# EAGLE design DCDC-BASE-X2 (EAGLE 9.6.2)
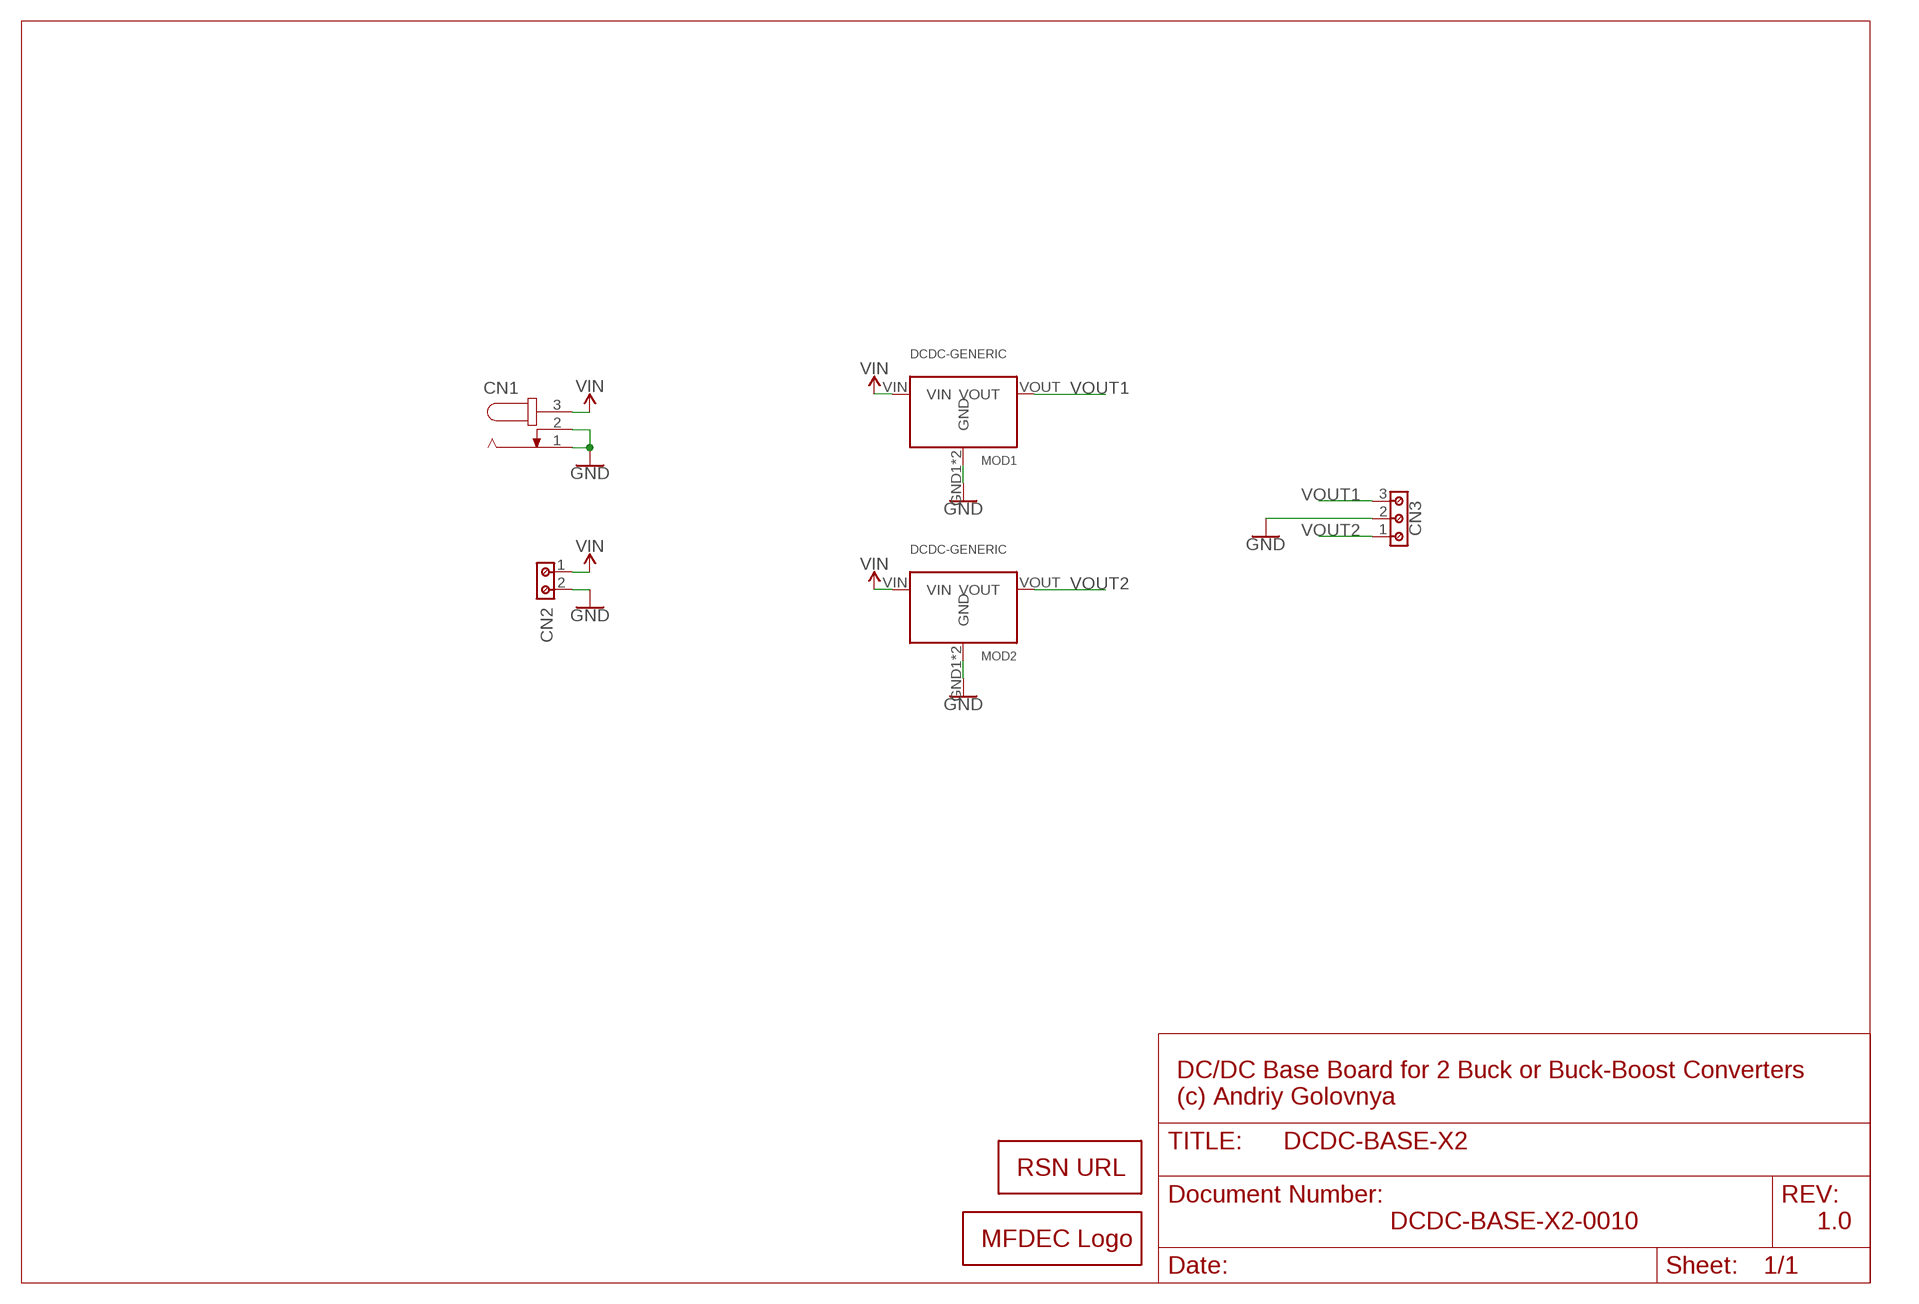
[diagram p0: schematic, sheet 1]

## Parts
CN1  JACK-PLUG1  [SPC4078]
CN2  691213510002  [691213510002]
CN3  691213510003  [691213510003]
LOGO1  RSNURL_QR_8MM  [RSNURL_QR_8MM]
LOGO2  MFDECLOGO_L_10MM  [MFDEC_L_10MM]
MOD1  DCDC-GENERIC  [DCDC-BOARD]
MOD2  DCDC-GENERIC  [DCDC-BOARD]

## Nets
GND: CN1.1 CN1.2 CN2.2 CN3.2 MOD1.GND1(GND) MOD1.GND2(GND) MOD2.GND1(GND) MOD2.GND2(GND)
VIN: CN1.3 CN2.1 MOD1.VIN MOD2.VIN
VOUT1: CN3.3 MOD1.VOUT
VOUT2: CN3.1 MOD2.VOUT

## Notes on the sheet
- DC/DC Base Board for 2 Buck or Buck-Boost Converters
  (c) Andriy Golovnya
- DCDC-BASE-X2-0010 | 1.0

## Library data of the parts
CN1 = con-jack:JACK-PLUG: DC POWER JACK Power Jack, DC, Right Angle, Through Hole, Rated 5A at 16VDC, PC Terminals Distributor: Farnell (www.Farnell.de) Drawing: 84N1161.pdf / 84N1162.pdf Manufacturer: SPC Technology (www.spctechnology.com) Type: SPC4077 / SPC 4078; OC_FARNELL: unknown; OC_NEWARK: unknown
CN2 = Wurth_Connectors_WR-TBL Rising Cage Clamp:691213510002: WR-TBL Serie 2135 - 5.08 mm Horizontal Entry Modular w. Rising Cage Clamp KIND PROPERTIES Pitch 5.08 mm MATERIAL PROPERTIES Insulator Material PA66 Insulator Flammability Rating UL94 V-0 Contact Material Copper Alloy Contact Plating Tin over Nickel Contact Type Stamped Terminal Screw Material Steel Terminal Screw Plating Zinc Wire Guard Material Copper Alloy GENERAL INFORMATION Operating Temperature -30 up to +120 °C Compliance ROHS & Reach ELECTRICAL PROPERTIES IR UL 14 A IR VDE 14 A Working Voltage [UL] 300 V (AC) Working Voltage [VDE] 250 V (AC) Withstanding Voltage [UL] 1600 V (AC) Withstanding Voltage [VDE] 2000 V (AC) Contact Resistance 20 mΩ MECHANICAL PROPERTIES Wire Strip Length 6 Screw M3 CERTIFICATION UL Approval E150931 VDE Approval 40021366 PACKAGING PROPERTIES Packaging Box <https://www.we-online.com/catalog/media/o32805v209%20Family_WR-TBL2_Series2135.jpg> Details see: https://www.we-online.com/catalog/en/TBL_5_08_2135_HORIZONTAL_ENTRY_MODULAR_69121351000x/ Updated by Ella Wu 2019-11-26 2019(C) Wurth Elektronik; IR-UL: 14A; IR-VDE: 14A; PART-NUMBER: 691213510002; PINS: 2; PITCH: 5.08mm; TYPE: Horizontal; WIRE: 14 to 30 (AWG) 2.08 to 0.0509 (mm²); WORKING-VOLTAGE-UL: 300V (AC); WORKING-VOLTAGE-VDE: 250V (AC)
CN3 = Wurth_Connectors_WR-TBL Rising Cage Clamp:691213510003: WR-TBL Serie 2135 - 5.08 mm Horizontal Entry Modular w. Rising Cage Clamp KIND PROPERTIES Pitch 5.08 mm MATERIAL PROPERTIES Insulator Material PA66 Insulator Flammability Rating UL94 V-0 Contact Material Copper Alloy Contact Plating Tin over Nickel Contact Type Stamped Terminal Screw Material Steel Terminal Screw Plating Zinc Wire Guard Material Copper Alloy GENERAL INFORMATION Operating Temperature -30 up to +120 °C Compliance ROHS & Reach ELECTRICAL PROPERTIES IR UL 14 A IR VDE 14 A Working Voltage [UL] 300 V (AC) Working Voltage [VDE] 250 V (AC) Withstanding Voltage [UL] 1600 V (AC) Withstanding Voltage [VDE] 2000 V (AC) Contact Resistance 20 mΩ MECHANICAL PROPERTIES Wire Strip Length 6 Screw M3 CERTIFICATION UL Approval E150931 VDE Approval 40021366 PACKAGING PROPERTIES Packaging Box <https://www.we-online.com/catalog/media/o32805v209%20Family_WR-TBL2_Series2135.jpg> Details see: https://www.we-online.com/catalog/en/TBL_5_08_2135_HORIZONTAL_ENTRY_MODULAR_69121351000x/ Updated by Ella Wu 2019-11-26 2019(C) Wurth Elektronik; IR-UL: 14A; IR-VDE: 14A; PART-NUMBER: 691213510003; PINS: 3; PITCH: 5.08mm; TYPE: Horizontal; WIRE: 14 to 30 (AWG) 2.08 to 0.0509 (mm²); WORKING-VOLTAGE-UL: 300V (AC); WORKING-VOLTAGE-VDE: 250V (AC)
LOGO1 = _my_logos:RSNURL: RedScorp.Net URL
LOGO2 = _my_logos:MFDECLOGO: Midnight Fog - Digital Eye Candy LOGO
MOD1 MOD2 = DCDC:DCDC-GENERIC

## Net classes
0 default: width 0.254 mm

## Board
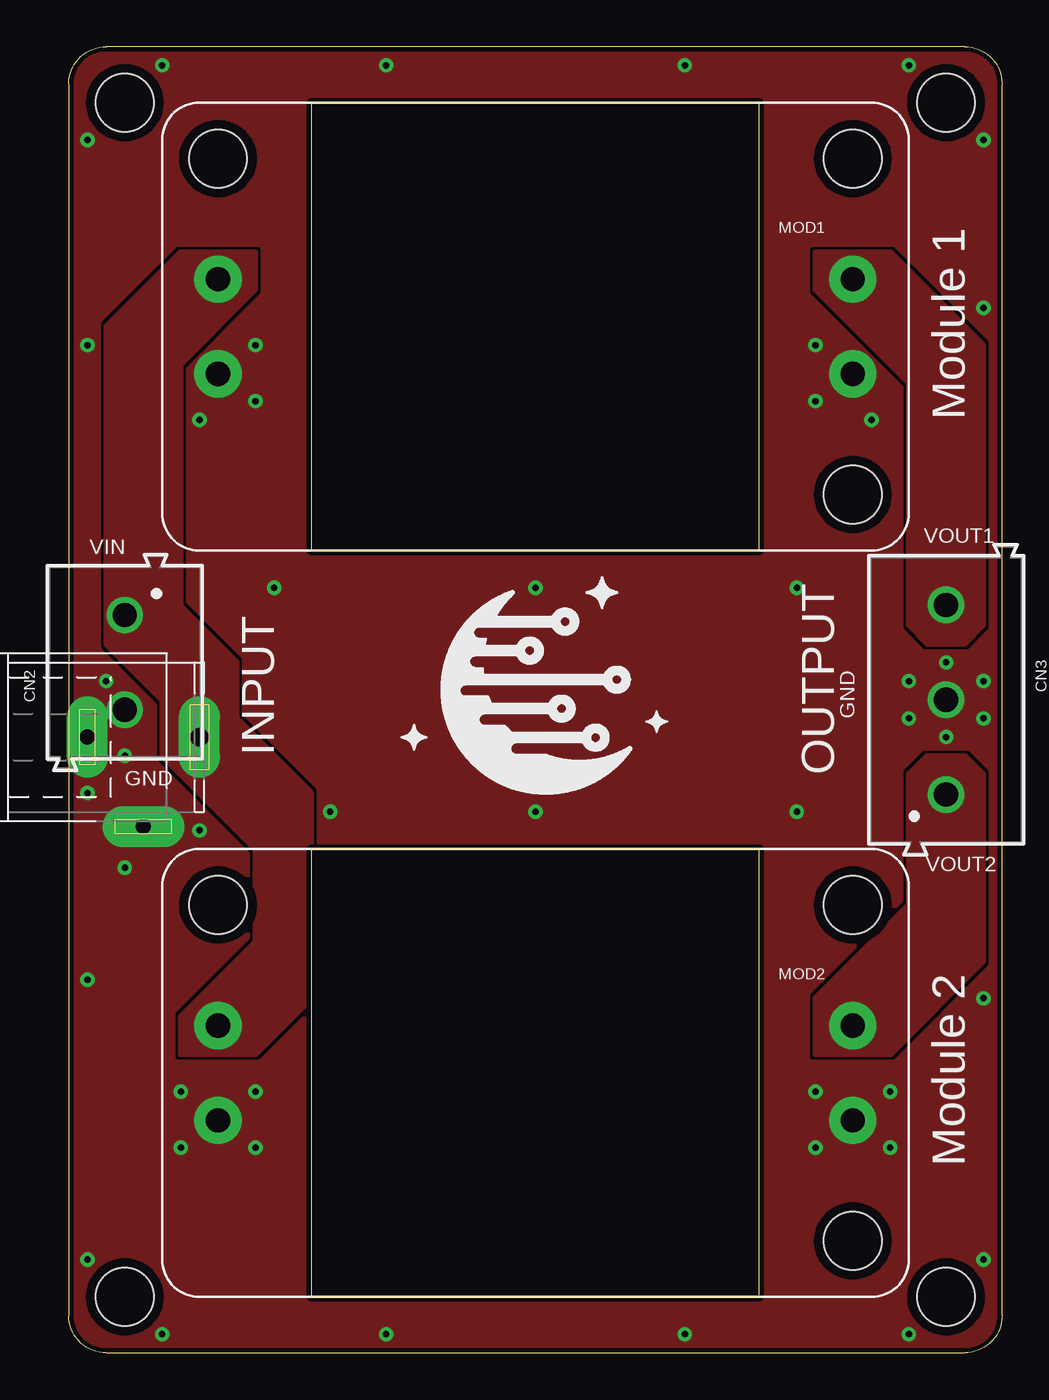
[diagram p1: board, top side]
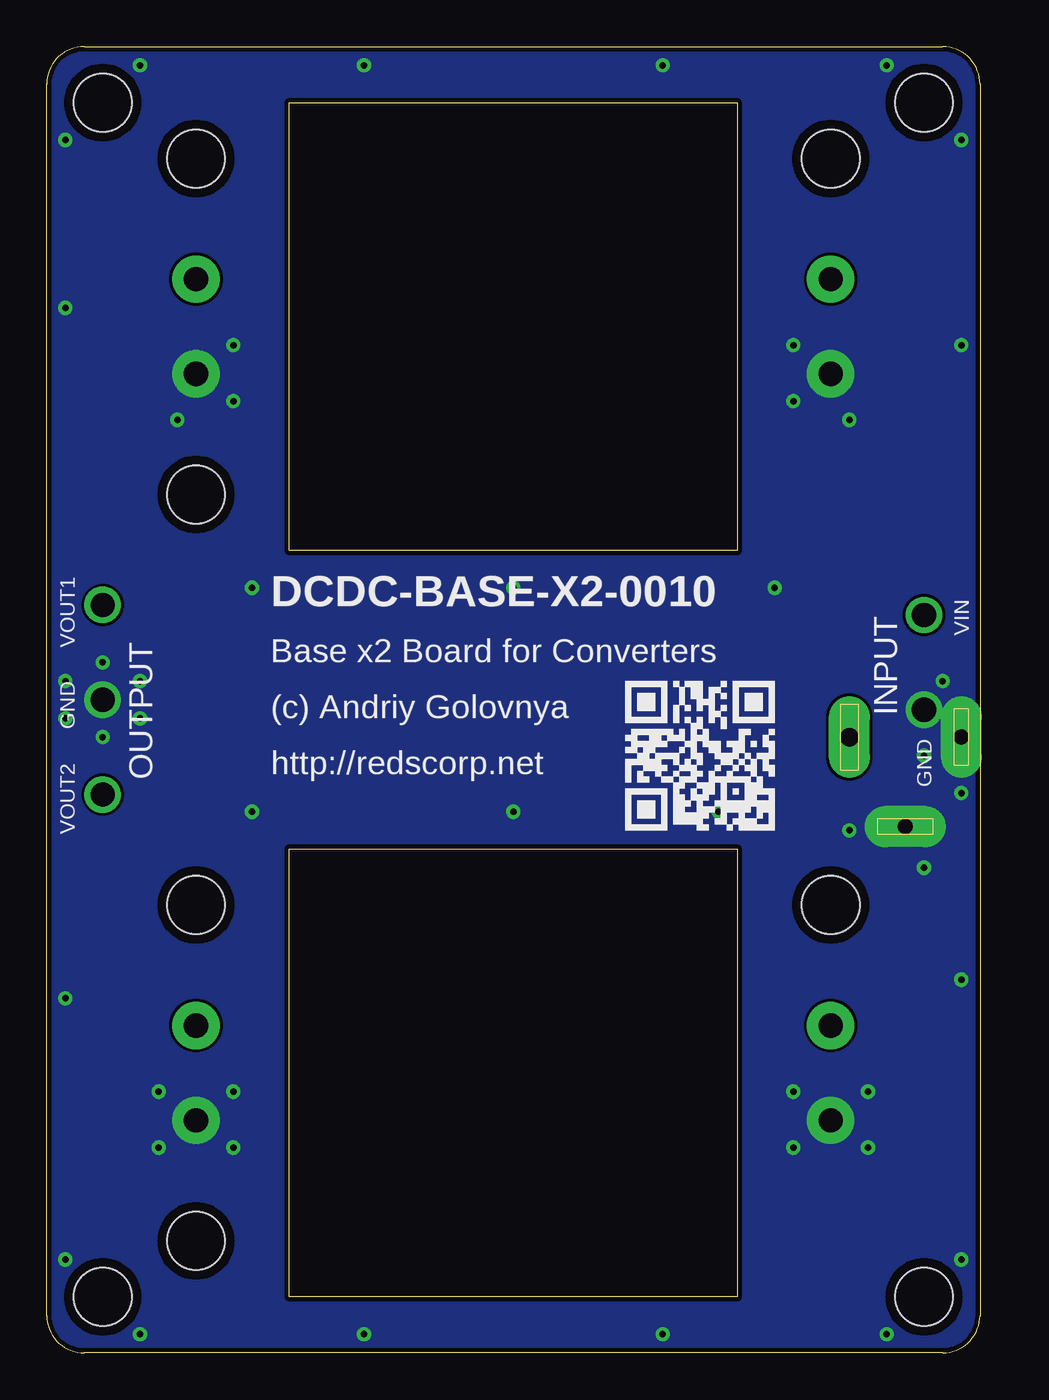
[diagram p2: board, bottom side, seen from below]

Size 50 x 70 mm. Coordinates in mm from the lower left corner, seen from the top.
Outline: 2,0 48,0 arc90 50,2 50,68 arc90 48,70 2,70 arc90 0,68 0,2 arc90 2,0
Copper layers (1*16): Top 0.035mm / dielectric 1.5mm / Bottom 0.035mm
Design rules "default *": minimum track width 6mil, minimum drill 0.35mm, track to track 6mil, track to pad 6mil, pad to pad 6mil, via to via 6mil, smd to smd 6mil, copper to edge 10mil, drill to drill 6mil, minimum pad ring 10mil, minimum via ring 8mil, stop-mask expansion 4mil, vias tented up to drill 20mil, thermal gap 10mil
Holes 3.1 mm at 3,67 47,67 47,3 3,3

### Footprints (pad centres in the part's own frame; a part is rotated, then mirrored left to right if it is on the bottom)
SPC4078 = drill 0.8 pad 2.184 long: 1 -3,0; 2 0,-4.8 | drill 1 pad 2.184 long: 3 3,0
691213510002 = drill 1.3: 1 -2.54,0; 2 2.54,0
691213510003 = drill 1.3: 1 -5.08,0; 2 0,0; 3 5.08,0
DCDC-BOARD = drill 1.3 pad 2.54: GND1 -17,-2.54; GND2 17,-2.54; VIN -17,2.54; VOUT 17,2.54 | hole 3.1: 17,-9; 17,9; -17,9

### Placement (x,y rotation side)
CN1  4,33 0 top
CN2  3,37 270 top
CN3  47,35 90 top
LOGO1  19,28 0 bottom
LOGO2  17,29 0 top
MOD1  25,55 0 top
MOD2  25,15 0 top

### Tracks (layer width: path | path; a pad name or v marks a point on that pad's centre or on a via)
GND  (via drill 0.35)
  other vias: 2,36 3,32 1,30 7,28 3,26 10,54 10,51 7,50 6,14 10,14 10,11 6,11 40,14 44,14 44,11 40,11 40,54 40,51 43,50 45,69 49,65 5,69 1,65 5,1 1,5 45,1 49,5 49,36 49,34 45,36 45,34 39,41 39,29 11,41 14,29 25,41 25,29 33,69 17,69 17,1 33,1 1,20 1,54 49,56 49,19 47,37 47,33
  pour Top (rank 3, no thermals): 50,0 -5,0 -5,70 50,70
  pour Bottom (rank 3, no thermals): 0,70 0,0 55,0 55,70
  cutout Top: 47,1 arc-180 47,5 arc-180
  cutout Top: 47,65 arc-180 47,69 arc-180
  cutout Top: 3,65 arc-180 3,69 arc-180
  cutout Bottom: 3,65 arc-180 3,69 arc-180
  cutout Bottom: 47,65 arc-180 47,69 arc-180
  cutout Bottom: 47,1 arc-180 47,5 arc-180
GND1
  cutout Top: 8,62 arc-180 8,66 arc-180
  cutout Bottom: 8,62 arc-180 8,66 arc-180
GND2
  cutout Top: 42,62 arc-180 42,66 arc-180
  cutout Bottom: 42,62 arc-180 42,66 arc-180
GND3
  cutout Top: 47,1 arc-180 47,5 arc-180
  cutout Bottom: 47,1 arc-180 47,5 arc-180
GND4
  cutout Top: 3,1 arc-180 3,5 arc-180
  cutout Bottom: 3,1 arc-180 3,5 arc-180
GND5
  cutout Top: 3,1 arc-180 3,5 arc-180
  cutout Bottom: 3,1 arc-180 3,5 arc-180
GND6
  cutout Top: 42,44 arc-180 42,48 arc-180
  cutout Bottom: 42,44 arc-180 42,48 arc-180
GND7
  cutout Top: 42,22 arc-180 42,26 arc-180
  cutout Bottom: 42,22 arc-180 42,26 arc-180
GND8
  cutout Top: 8,22 arc-180 8,26 arc-180
  cutout Bottom: 8,22 arc-180 8,26 arc-180
GND9
  cutout Top: 42,4 arc-180 42,8 arc-180
  cutout Bottom: 42,4 arc-180 42,8 arc-180
VIN
  pour Top (no thermals): 2,55 2,38 5,35 5,32 10,27 10,22 6,18 6,16 10,16 13,19 13,30 9,34 9,37 6,40 6,53 10,57 10,59 6,59
VOUT1
  pour Top (no thermals): 40,59 40,57 45,52 45,39 46,38 48,38 49,39 49,54 44,59
VOUT2
  pour Top (no thermals): 40,16 40,19 45,24 45,31 46,32 48,32 49,31 49,21 44,16

### Text on the board
tPlace: Module 1 | VIN | VOUT1 | GND | INPUT | OUTPUT | GND | VOUT2 | Module 2
bPlace: VOUT1 | VIN | INPUT | DCDC-BASE-X2-0010 | OUTPUT | Base x2 Board for Converters | GND | (c) Andriy Golovnya | GND | VOUT2 | http://redscorp.net